# EasyEDA Pro project 赛博樱花灯.epro, schematic Schematic3_1
Board Name: 耳饰灯; Create Date: 2025-05-09; Page Name: P1; Project Name: 噬菌体拾音灯; Schematic Name: Schematic3; Update Date: 2025-05-09; Company: 嘉立创EDA; Page Size: A3; Version: V1.0
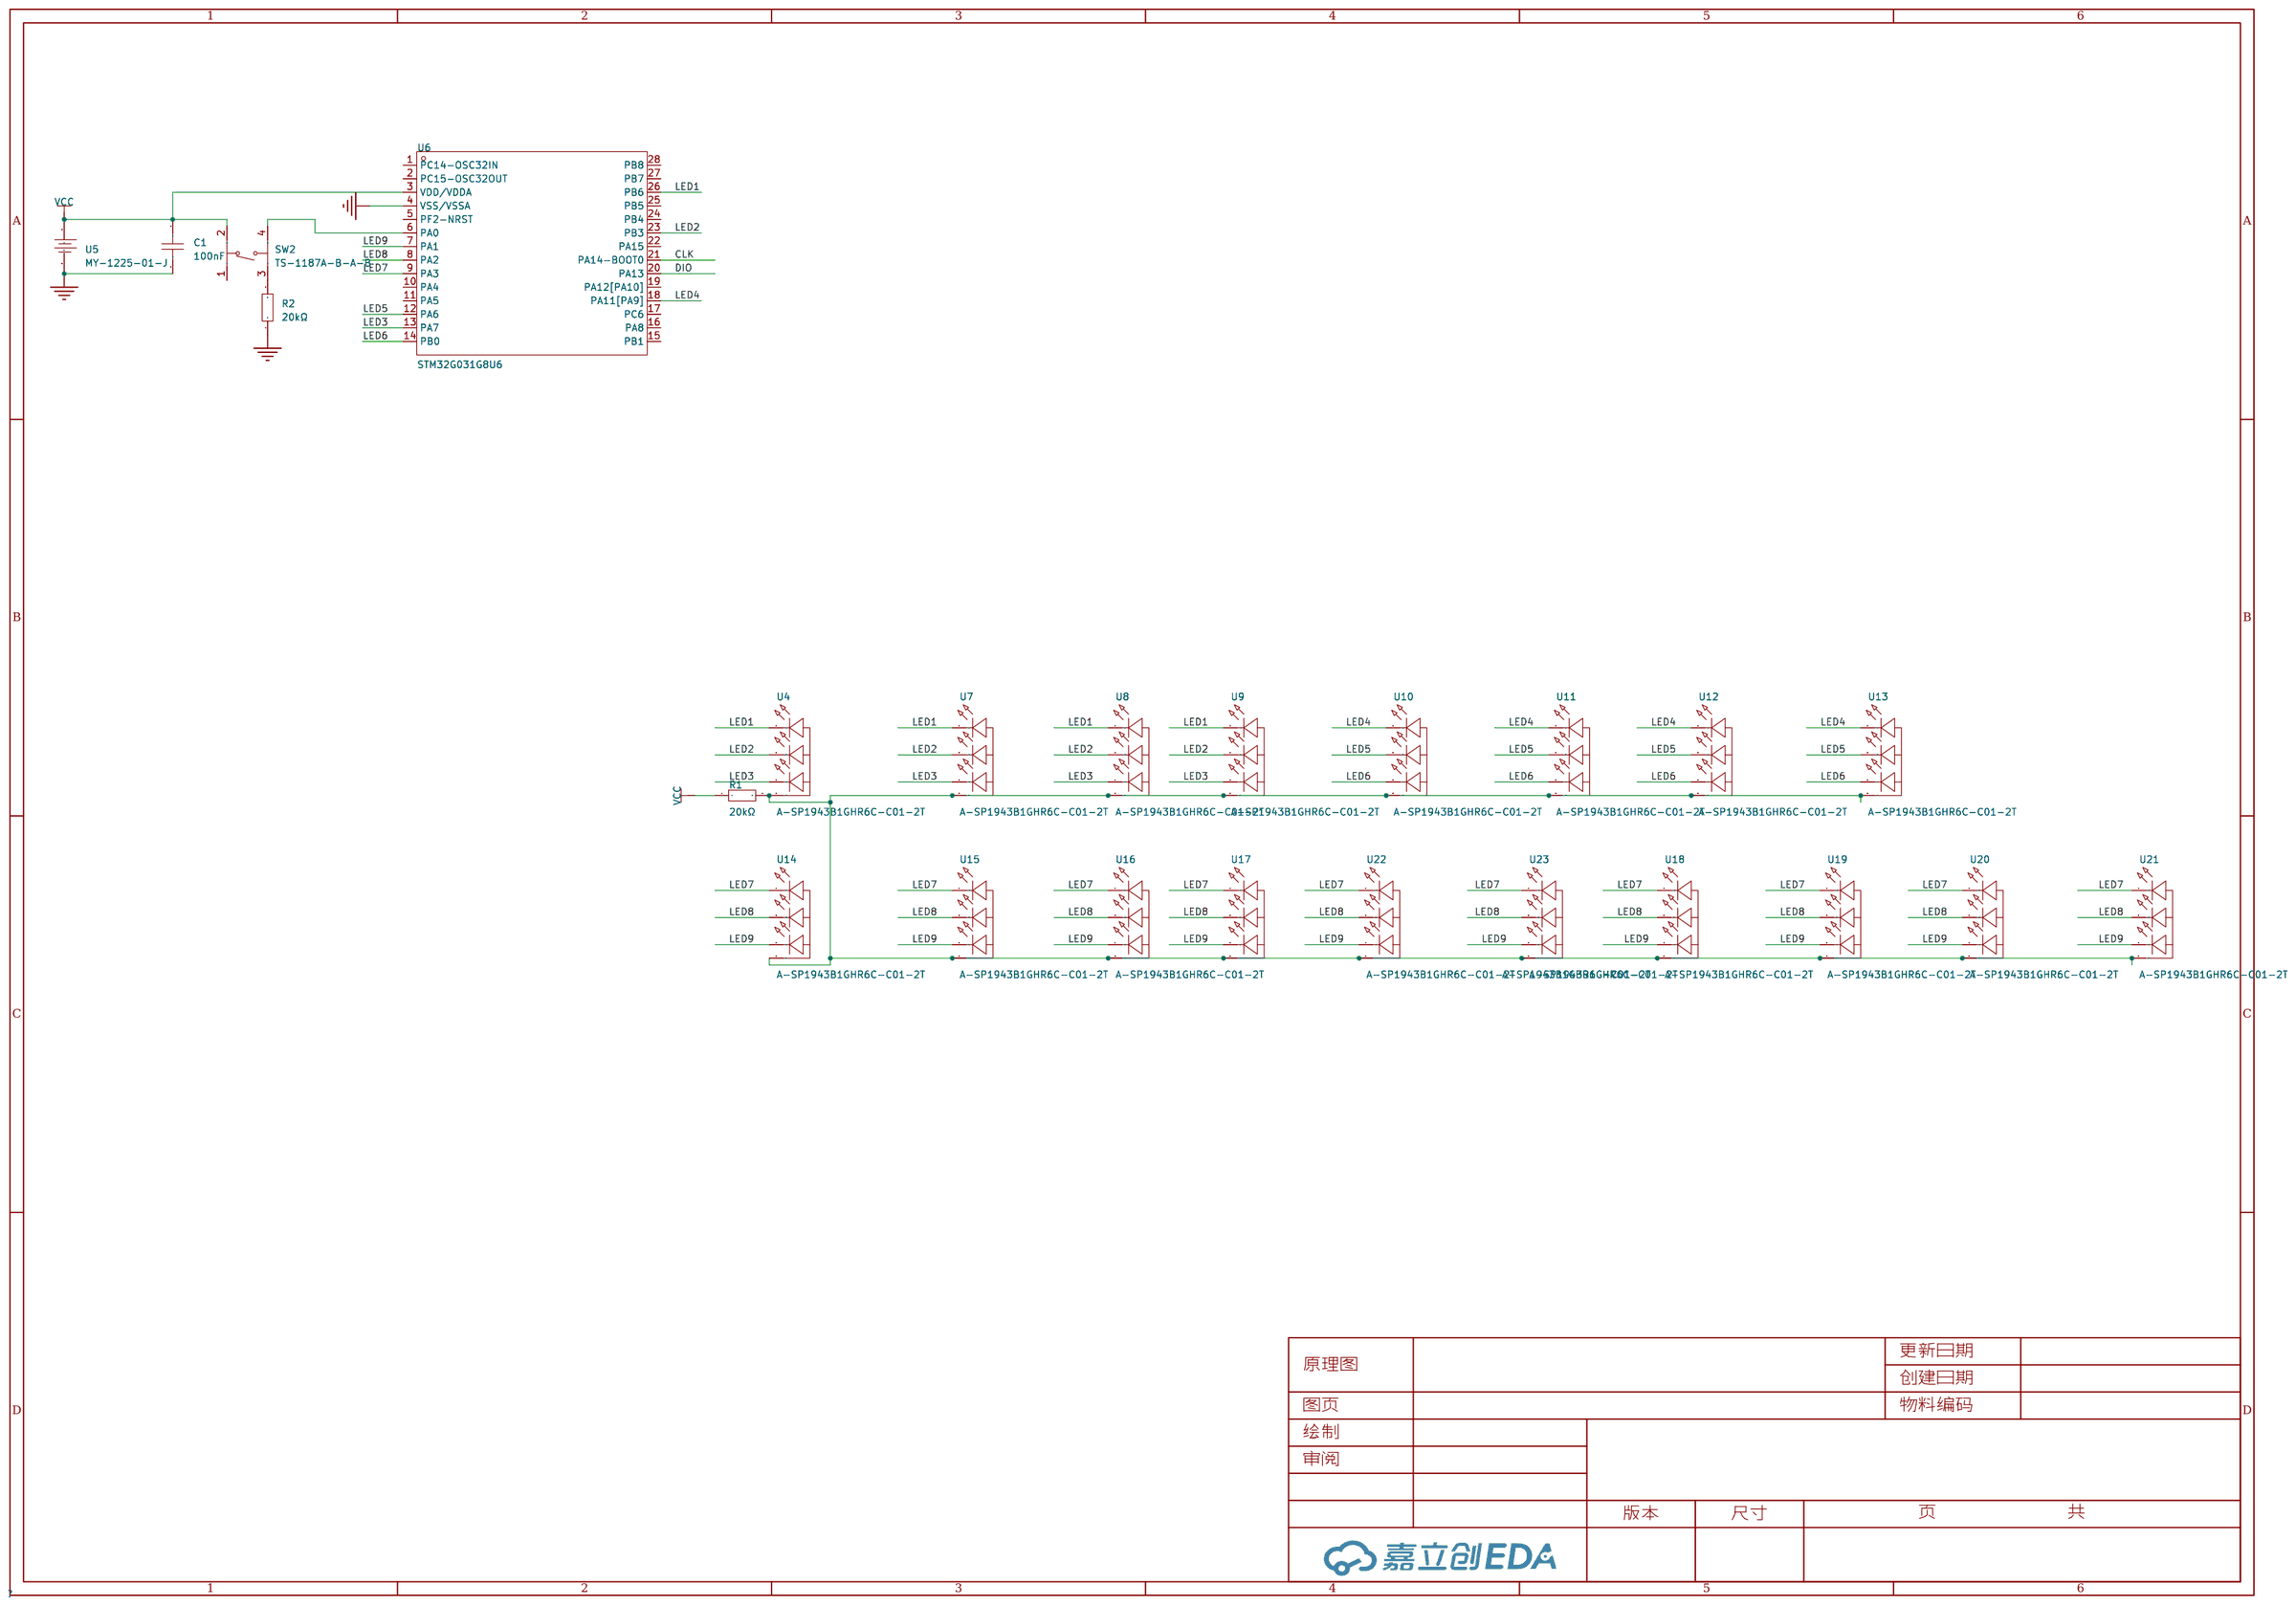
[diagram p7: schematic sheet]

## Parts
C1  100nF  [C0603]
R1  20kΩ  [R0603]
R2  20kΩ  [R0603]
SW2  TS-1187A-B-A-B  [SW-SMD_4P-L5.1-W5.1-P3.70-LS6.5-TL_H1.5]
U4  A-SP1943B1GHR6C-C01-2T  [LED-SMD_4P-L1.6-W1.5-BL_A-SP1943B1GHR6C-C01-2T]
U5  MY-1225-01-J  [BAT-SMD_MY-1225-01-J]
U6  STM32G031G8U6  [UFQFPN-28_L4.0-W4.0-P0.50-BL]
U7  A-SP1943B1GHR6C-C01-2T  [LED-SMD_4P-L1.6-W1.5-BL_A-SP1943B1GHR6C-C01-2T]
U8  A-SP1943B1GHR6C-C01-2T  [LED-SMD_4P-L1.6-W1.5-BL_A-SP1943B1GHR6C-C01-2T]
U9  A-SP1943B1GHR6C-C01-2T  [LED-SMD_4P-L1.6-W1.5-BL_A-SP1943B1GHR6C-C01-2T]
U10  A-SP1943B1GHR6C-C01-2T  [LED-SMD_4P-L1.6-W1.5-BL_A-SP1943B1GHR6C-C01-2T]
U11  A-SP1943B1GHR6C-C01-2T  [LED-SMD_4P-L1.6-W1.5-BL_A-SP1943B1GHR6C-C01-2T]
U12  A-SP1943B1GHR6C-C01-2T  [LED-SMD_4P-L1.6-W1.5-BL_A-SP1943B1GHR6C-C01-2T]
U13  A-SP1943B1GHR6C-C01-2T  [LED-SMD_4P-L1.6-W1.5-BL_A-SP1943B1GHR6C-C01-2T]
U14  A-SP1943B1GHR6C-C01-2T  [LED-SMD_4P-L1.6-W1.5-BL_A-SP1943B1GHR6C-C01-2T]
U15  A-SP1943B1GHR6C-C01-2T  [LED-SMD_4P-L1.6-W1.5-BL_A-SP1943B1GHR6C-C01-2T]
U16  A-SP1943B1GHR6C-C01-2T  [LED-SMD_4P-L1.6-W1.5-BL_A-SP1943B1GHR6C-C01-2T]
U17  A-SP1943B1GHR6C-C01-2T  [LED-SMD_4P-L1.6-W1.5-BL_A-SP1943B1GHR6C-C01-2T]
U18  A-SP1943B1GHR6C-C01-2T  [LED-SMD_4P-L1.6-W1.5-BL_A-SP1943B1GHR6C-C01-2T]
U19  A-SP1943B1GHR6C-C01-2T  [LED-SMD_4P-L1.6-W1.5-BL_A-SP1943B1GHR6C-C01-2T]
U20  A-SP1943B1GHR6C-C01-2T  [LED-SMD_4P-L1.6-W1.5-BL_A-SP1943B1GHR6C-C01-2T]
U21  A-SP1943B1GHR6C-C01-2T  [LED-SMD_4P-L1.6-W1.5-BL_A-SP1943B1GHR6C-C01-2T]
U22  A-SP1943B1GHR6C-C01-2T  [LED-SMD_4P-L1.6-W1.5-BL_A-SP1943B1GHR6C-C01-2T]
U23  A-SP1943B1GHR6C-C01-2T  [LED-SMD_4P-L1.6-W1.5-BL_A-SP1943B1GHR6C-C01-2T]

## Library data of the parts
C1 = CC0603KRX7R9BB104: 容值:100nF;精度:±10%;额定电压:50V;材质(温度系数):X7R;; LCSC Part Name: 100nF ±10% 50V; Supplier Part: C14663; Manufacturer: YAGEO(国巨); Supplier Footprint: 0603; JLCPCB Part Class: 基础库; Datasheet: https://atta.szlcsc.com/upload/public/pdf/source/20180910/C282072_33301C7F631E79921B82A8DAC6BCC5B3.pdf; Supplier: LCSC; Tolerance: ±10%; Voltage Rated: 50V; Temperature Coefficient: X7R
R1 R2 = 0603WAF2002T5E: 电阻类型:厚膜电阻;阻值:20kΩ;精度:±1%;功率:100mW;最大工作电压:75V;温度系数:±100ppm/℃;; LCSC Part Name: 20kΩ ±1% 100mW 厚膜电阻; Supplier Part: C4184; Manufacturer: UNI-ROYAL(厚声); Supplier Footprint: 0603; JLCPCB Part Class: 基础库; Datasheet: https://atta.szlcsc.com/upload/public/pdf/source/20200306/C422600_1E6D84923E4A46A82E41ADD87F860B5C.pdf; Supplier: LCSC; Type: 厚膜电阻; Tolerance: ±1%; Power(Watts): 100mW; Overload Voltage (Max): 75V; Temperature Coefficient: ±100ppm/℃; Operating Temperature Range: -55℃~+155℃
SW2 = TS-1187A-B-A-B: 电路结构:单刀单掷;按钮形状:圆形按钮;作用力:160gf;安装方式:立贴;开关长度:5.1mm;开关宽度:5.1mm;开关高度:1.5mm;带支架:不带;触点电流:50mA;额定电压(DC):12V;绝缘电阻:-;带灯:无;机械寿命:10万次;; LCSC Part Name: 5.1*5.1*1.5mm 立贴 轻触开关; Supplier Part: C318884; Manufacturer: XKB Connectivity(中国星坤); Supplier Footprint: SMD; JLCPCB Part Class: 基础库; Datasheet: https://atta.szlcsc.com/upload/public/pdf/source/20200227/C318890_053E50208A88A7BA1965D8746000774E.pdf; Supplier: LCSC; Circuit: 单刀单掷; Actuator Style: 圆形按钮; Operating Force: 160gf; Mounting Style: 立贴; Switch Length: 5.1mm; Switch Width: 5.1mm; Switch Height: 1.5mm; Strike Gundam: 不带; Contact Current: 50mA; Voltage Rating (DC): 12V; Actuator/Cap Color: 金色; With Lamp: 无; Mechanical Life: 10万次; Operating Temperature: -30℃~+85℃
U4 U7-U23 = A-SP1943B1GHR6C-C01-2T: 发光颜色:红色,绿色,蓝色;功率:95mW；60mW;主波长:465nm~475nm；520nm~535nm；622nm;二极管配置:共阳极;透镜颜色:无色透明透镜;发光强度:36mcd~72mcd；225mcd~450mcd；45mcd~90mcd;发光角度:130°;载带方式:正贴;工作温度:-40℃~+85℃;; LCSC Part Name: 1615RGB三色正贴; Supplier Part: C19171342; Manufacturer: Amicc(欧密格光电); Supplier Footprint: SMD-4P,1.6x1.5mm; JLCPCB Part Class: Extended Part; Datasheet: https://atta.szlcsc.com/upload/public/pdf/source/20231108/78302422244B66875620C004AAA083D4.pdf; Supplier: LCSC; Emitted Color: 红色,绿色,蓝色; Power Dissipation: 95mW；60mW; Dominant Wavelength: 465nm~475nm；520nm~535nm；622nm; Diode Configuration: 共阳极; Lens Color: 无色透明透镜; Luminous Intensity: 36mcd~72mcd；225mcd~450mcd；45mcd~90mcd; Viewing Angle: 130°; Mounting Sytle: 正贴; Operating Temperature: -40℃~+85℃
U5 = MY-1225-01-J: 连接器类型:电池扣;适用电池规格:CR1225;触头材质:磷青铜;触头镀层:镍;; LCSC Part Name: 电池扣 适用电池:CR1225; Supplier Part: C20606803; Manufacturer: MYOUNG(美阳); Supplier Footprint: SMD; JLCPCB Part Class: 扩展库; Datasheet: https://atta.szlcsc.com/upload/public/pdf/source/20240112/5F3E1879C0A7CE4C81C3832753D0FB05.pdf; Supplier: LCSC; Connector Type: 电池扣; Battery Type: CR1225; Contact Material: 磷青铜; Contact Plating: 镍
U6 = STM32G031G8U6: CPU内核:ARM-M系列;CPU最大主频:64MHz;应用领域:-;; LCSC Part Name: 主流Arm Cortex-M0+ MCU，具有64 KB Flash存储器、8 KB RAM、64 MHz CPU、2x USART、定时器、ADC和通信接口，1.7-3.6V; Supplier Part: C432211; Manufacturer: ST(意法半导体); Supplier Footprint: UFQFPN-28(4x4); JLCPCB Part Class: Extended Part; Datasheet: https://atta.szlcsc.com/upload/public/pdf/source/20190927/C432211_623EEFA1D407096BEEBF7364175DF17E.pdf; Supplier: LCSC; CPU Core: ARM-M系列; CPU Maximum Speed: 64MHz; Program Storage Size: 64KB; Program Memory Type: FLASH; Number of I/O: 26; ADC (Bit): 12bit; Low Voltage Detection Threshold: 1.7V~3.6V

## Nets
GND: C1.1 R2.1 U5.2 U6.4(VSS/VSSA)
VCC: C1.2 R1.1 SW2.2(B) U5.1 U6.3(VDD/VDDA)
CLK: U6.21(PA14-BOOT0)
DIO: U6.20(PA13)
LED1: U4.1 U6.26(PB6) U7.1 U8.1 U9.1
LED2: U4.2 U6.23(PB3) U7.2 U8.2 U9.2
LED3: U4.4 U6.13(PA7) U7.4 U8.4 U9.4
LED4: U6.18(PA11[PA9]) U10.1 U11.1 U12.1 U13.1
LED5: U6.12(PA6) U10.2 U11.2 U12.2 U13.2
LED6: U6.14(PB0) U10.4 U11.4 U12.4 U13.4
LED7: U6.9(PA3) U14.1 U15.1 U16.1 U17.1 U18.1 U19.1 U20.1 U21.1 U22.1 U23.1
LED8: U6.8(PA2) U14.2 U15.2 U16.2 U17.2 U18.2 U19.2 U20.2 U21.2 U22.2 U23.2
LED9: U6.7(PA1) U14.4 U15.4 U16.4 U17.4 U18.4 U19.4 U20.4 U21.4 U22.4 U23.4
$1N202: R1.2 U4.3 U7.3 U8.3 U9.3 U10.3 U11.3 U12.3 U13.3 U14.3 U15.3 U16.3 U17.3 U18.3 U19.3 U20.3 U21.3 U22.3 U23.3
$1N757: SW2.4(D) U6.6(PA0)
$1N2071: R2.2 SW2.3(C)

Not connected (* = marked no-connect by the designer): SW2 1(A); U6 1(PC14-OSC32IN) 2(PC15-OSC32OUT) 5(PF2-NRST) 10(PA4) 11(PA5) 15(PB1) 16(PA8) 17(PC6) 19(PA12[PA10]) 22(PA15) 24(PB4) 25(PB5) 27(PB7) 28(PB8)
